# Altium schematic sheet power.SchDoc: Fault-Tolerant Quadcopter
size A; DrawnBy: Vaughn Kottler; Engineer: Vaughn Kottler; Revision: A
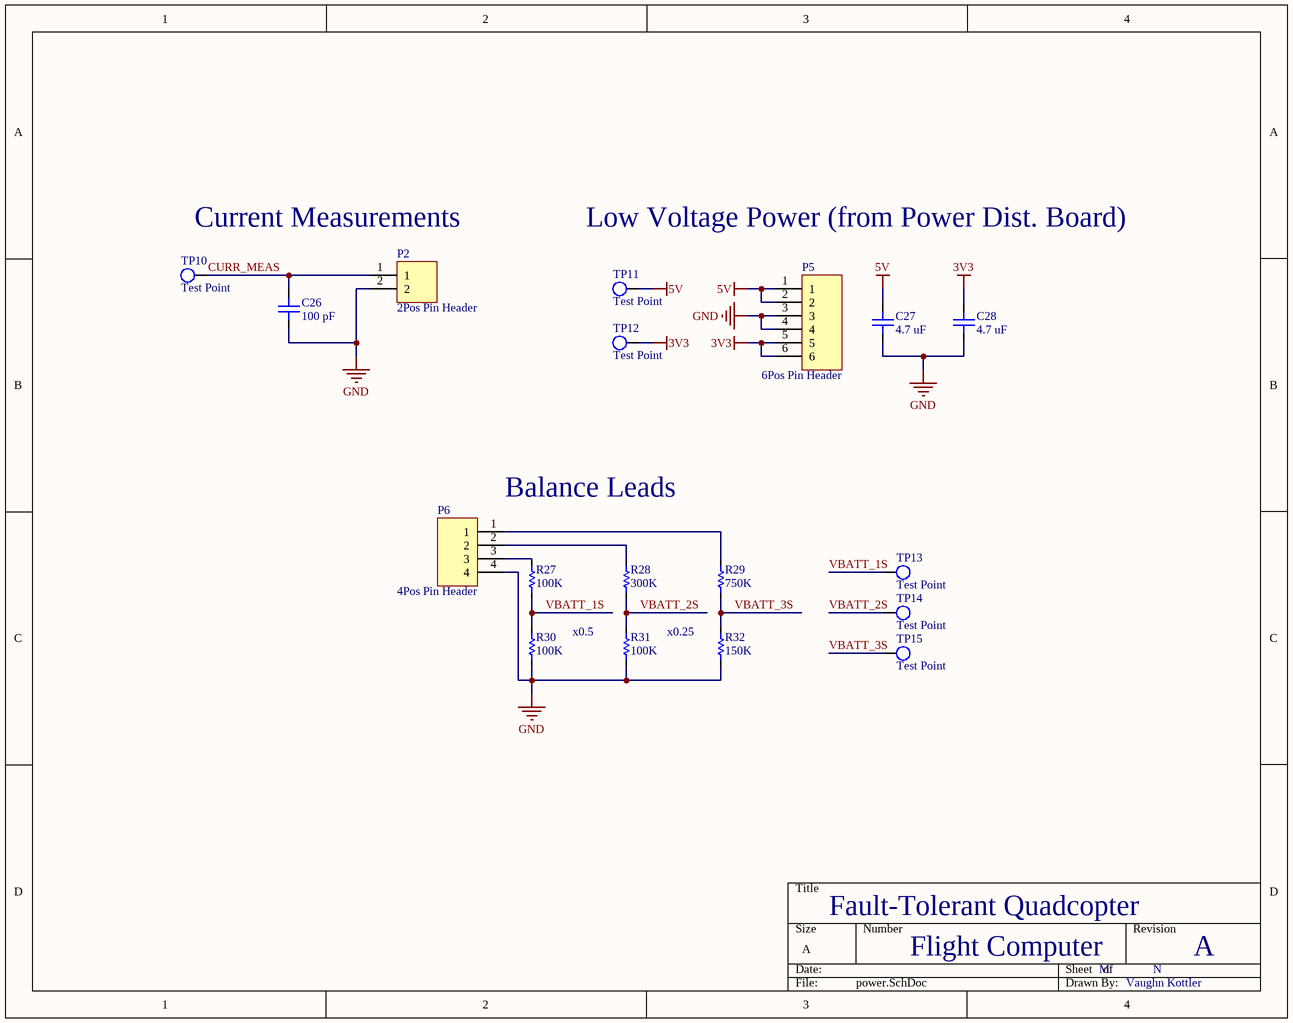
[diagram p0: power.SchDoc]

## Parts
C26  100 pF  [CAP-CER-0805-SHORT]
C27  4.7 uF  [CAP-CER-0805-TALL]
C28  4.7 uF  [CAP-CER-0805-TALL]
P2  2Pos Pin Header  [2Pos Pin Header JST]
P5  6Pos Pin Header  [6Pos Pin Header JST]
P6  4Pos Pin Header  [4Pos Pin Header JST]
R27  100K  [RES-0805]
R28  300K  [RES-0805]
R29  750K  [RES-0805]
R30  100K  [RES-0805]
R31  100K  [RES-0805]
R32  150K  [RES-0805]
TP10  Test Point  [0603 Test Point]
TP11  Test Point  [0603 Test Point]
TP12  Test Point  [0603 Test Point]
TP13  Test Point  [0603 Test Point]
TP14  Test Point  [0603 Test Point]
TP15  Test Point  [0603 Test Point]

## Nets
3V3: C28.2 P5.5 P5.6 TP12.1
5V: C27.2 P5.1 P5.2 TP11.1
GND: C26.1 C27.1 C28.1 P2.2 P5.3 P5.4 P6.4 R30.1 R31.1 R32.1
CURR_MEAS: C26.2 P2.1 TP10.1
VBATT_1S: R27.1 R30.2 TP13.1
VBATT_2S: R28.1 R31.2 TP14.1
VBATT_3S: R29.1 R32.2 TP15.1
NetP6_1: P6.1 R29.2
NetP6_2: P6.2 R28.2
NetP6_3: P6.3 R27.2

## Notes on the sheet
- Current Measurements
- Low Voltage Power (from Power Dist. Board)
- Balance Leads
- x0.5
- (near R32) x0.25
- Flight Computer
- M
- N

## Library data of the parts
C26 = CAP-CER-100pF-50V: ±0.25pF, 0805; ComponentLink1Description: Capacitor Book (Amazon); ComponentLink1URL: https://www.amazon.com/gp/product/B0728HBDRW/
C27 C28 = CAP-CER-4.7uF-10V: ±10%, 0805; ComponentLink1Description: Capacitor Book (Amazon); ComponentLink1URL: https://www.amazon.com/gp/product/B0728HBDRW/
P2 = 2Pos Pin Header: 0.1" Pitch 1x2
P5 = 6Pos Pin Header: 0.1" Pitch 1x6
P6 = 4Pos Pin Header: 0.1" Pitch 1x4
R27 R30 R31 = RES-100K-1/8W: 0805; ComponentLink1Description: Resistor Book (Amazon); ComponentLink1URL: https://www.amazon.com/gp/product/B071J21FYF/
R28 = RES-300K-1/8W: 0805; ComponentLink1Description: Resistor Book (Amazon); ComponentLink1URL: https://www.amazon.com/gp/product/B071J21FYF/
R29 = RES-750K-1/8W: 0805; ComponentLink1Description: Resistor Book (Amazon); ComponentLink1URL: https://www.amazon.com/gp/product/B071J21FYF/
R32 = RES-150K-1/8W: 0805; ComponentLink1Description: Resistor Book (Amazon); ComponentLink1URL: https://www.amazon.com/gp/product/B071J21FYF/
TP10-TP15 = Test Point: 0603; Supplier 1: Digi-Key; Supplier Part Number 1: A106145DKR-ND